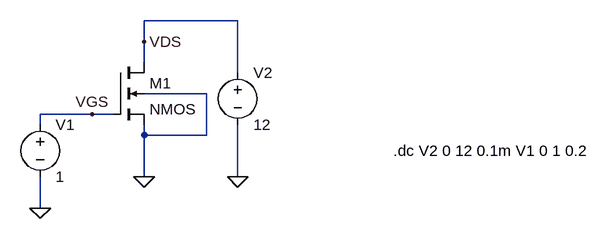
[diagram p0: schematic lab00_nmos.asc]
lab00_nmos.asc, the LTspice schematic file:
Version 4
SHEET 1 880 680
WIRE 240 16 96 16
WIRE 96 48 96 16
WIRE 96 80 96 48
WIRE 240 96 240 16
WIRE 192 128 96 128
WIRE 16 160 -64 160
WIRE 48 160 16 160
WIRE -64 176 -64 160
WIRE 96 192 96 176
WIRE 192 192 192 128
WIRE 192 192 96 192
WIRE 96 256 96 192
WIRE 240 256 240 176
WIRE -64 304 -64 256
FLAG 96 256 0
FLAG 240 256 0
FLAG -64 304 0
FLAG 16 160 VGS
FLAG 96 48 VDS
SYMBOL nmos4 48 80 R0
SYMATTR InstName M1
SYMBOL voltage -64 160 R0
WINDOW 123 0 0 Left 0
WINDOW 39 0 0 Left 0
SYMATTR InstName V1
SYMATTR Value 1
SYMBOL voltage 240 80 R0
WINDOW 123 0 0 Left 0
WINDOW 39 0 0 Left 0
SYMATTR InstName V2
SYMATTR Value 12
TEXT 480 216 Left 2 !.dc V2 0 12 0.1m V1 0 1 0.2

The netlist it stands for:
* lab00_nmos.asc
M1 VDS VGS 0 0 NMOS
V1 VGS 0 1
V2 VDS 0 12
.model NMOS NMOS
.model PMOS PMOS
.lib standard.mos
.dc V2 0 12 0.1m V1 0 1 0.2
.backanno
.end